# Altium schematic sheet Led.SchDoc
size A4; SheetNumber: 6; SheetTotal: 6
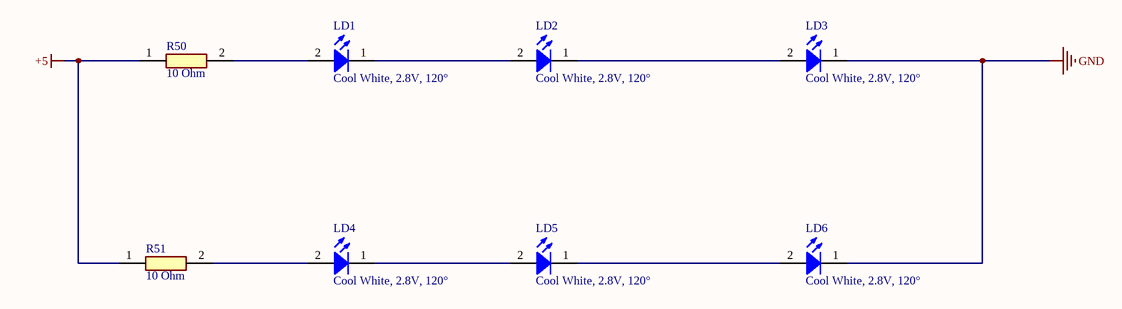
[diagram p0: Led.SchDoc]

## Parts
LD1  Cool White, 2.8V, 120°  [WL-SWTP_5630_L5.6W3H0.6]
LD2  Cool White, 2.8V, 120°  [WL-SWTP_5630_L5.6W3H0.6]
LD3  Cool White, 2.8V, 120°  [WL-SWTP_5630_L5.6W3H0.6]
LD4  Cool White, 2.8V, 120°  [WL-SWTP_5630_L5.6W3H0.6]
LD5  Cool White, 2.8V, 120°  [WL-SWTP_5630_L5.6W3H0.6]
LD6  Cool White, 2.8V, 120°  [WL-SWTP_5630_L5.6W3H0.6]
R50  10 Ohm  [Weerstand LEDS]
R51  10 Ohm  [Weerstand LEDS]

## Nets
+5: R50.1 R51.1
GND: LD3.1(K) LD6.1(K)
NetLD1_1: LD1.1(K) LD2.2(A)
NetLD1_2: LD1.2(A) R50.2
NetLD2_1: LD2.1(K) LD3.2(A)
NetLD4_1: LD4.1(K) LD5.2(A)
NetLD4_2: LD4.2(A) R51.2
NetLD5_1: LD5.1(K) LD6.2(A)

## Library data of the parts
LD1-LD6 = 158563260A: WL-SWTP SMT White Top view PLCC, size 5630, Cool White, 2.8V, 120°; Manufacturer: Wurth Elektronik; Color Rendering Index: 85; Correlated Color Temperature: 6000K; Luminous Flux: 35lm; Chip Technology: InGaN; Viewing Angle: 120°; ComponentLink1URL: http://www.we-online.de; Size: 5630; Emitting Color: Cool White; Forward Voltage: 2.8V; ComponentLink2URL: https://www.we-online.com/catalog/datasheet/158563260A.pdf; ComponentLink1Description: Manufacturer Link; ComponentLink2Description: Datasheet; Manufacturer Part Number: 158563260A; Operating Temperature max.: 85C; Mounting Technology: SMT; Packaging: Tape and Reel; Height: 0.6mm; Length: 5.6mm; Operating Temperature min.: -40C; Width: 3mm
R50 R51 = EP5WS10RJ: Resistor LED; Manufacturer_Name: TE Connectivity; Datasheet Link: https://www.te.com/commerce/DocumentDelivery/DDEController?Action=showdoc&DocId=Data+Sheet%7F9-1773463-6%7FA%7Fpdf%7FEnglish%7FENG_DS_9-1773463-6_A.pdf%7F2176083-1; Manufacturer_Part_Number: EP5WS10RJ